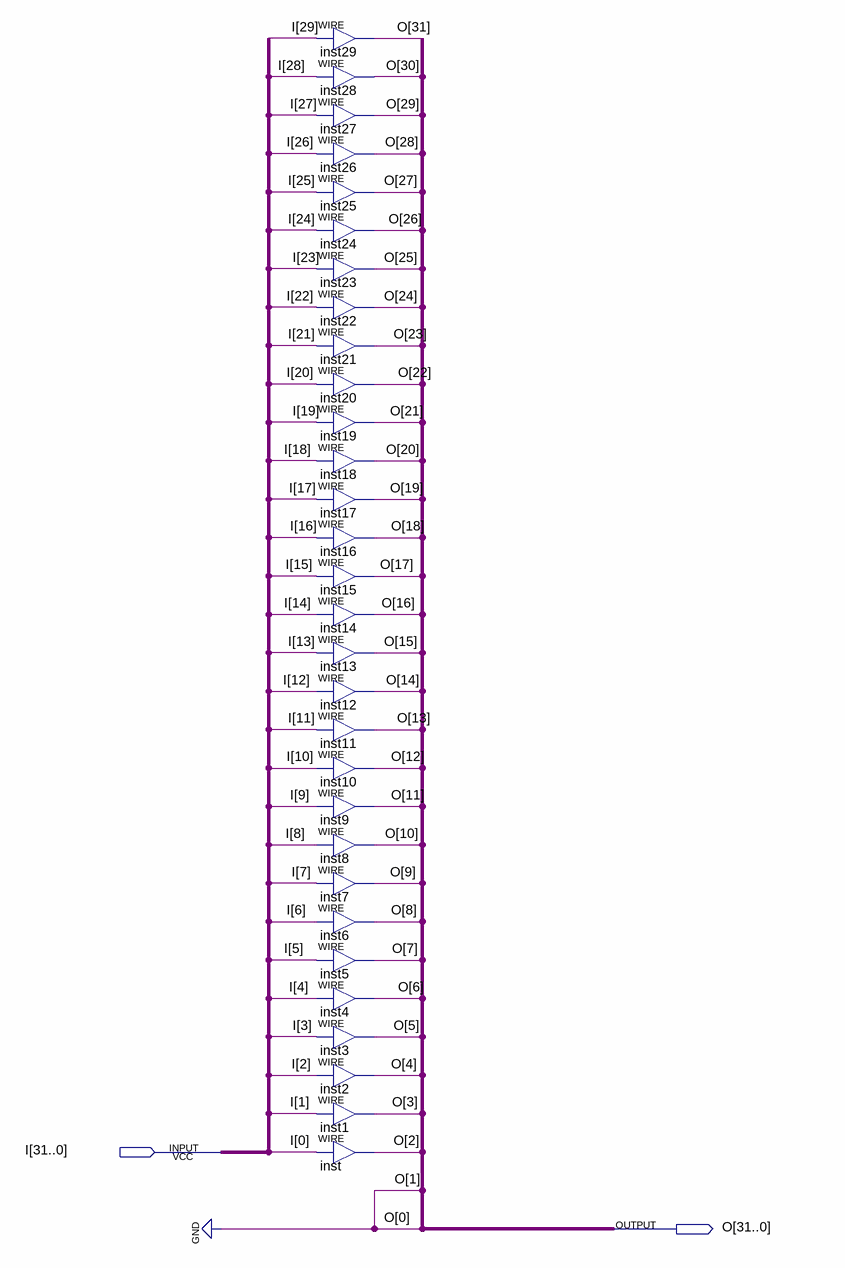
[diagram p0: schematic sheet]
// Quartus schematic Shiftleft2.bdf as structural Verilog: 30 symbols, 2 pins
module Shiftleft2 (
  input  [31:0] I,
  output [31:0] O
);

  assign O[31] = I[29];  // WIRE inst29
  assign O[30] = I[28];  // WIRE inst28
  assign O[29] = I[27];  // WIRE inst27
  assign O[28] = I[26];  // WIRE inst26
  assign O[27] = I[25];  // WIRE inst25
  assign O[26] = I[24];  // WIRE inst24
  assign O[25] = I[23];  // WIRE inst23
  assign O[24] = I[22];  // WIRE inst22
  assign O[23] = I[21];  // WIRE inst21
  assign O[22] = I[20];  // WIRE inst20
  assign O[21] = I[19];  // WIRE inst19
  assign O[20] = I[18];  // WIRE inst18
  assign O[19] = I[17];  // WIRE inst17
  assign O[18] = I[16];  // WIRE inst16
  assign O[17] = I[15];  // WIRE inst15
  assign O[16] = I[14];  // WIRE inst14
  assign O[15] = I[13];  // WIRE inst13
  assign O[14] = I[12];  // WIRE inst12
  assign O[13] = I[11];  // WIRE inst11
  assign O[12] = I[10];  // WIRE inst10
  assign O[11] = I[9];  // WIRE inst9
  assign O[10] = I[8];  // WIRE inst8
  assign O[9] = I[7];  // WIRE inst7
  assign O[8] = I[6];  // WIRE inst6
  assign O[7] = I[5];  // WIRE inst5
  assign O[6] = I[4];  // WIRE inst4
  assign O[5] = I[3];  // WIRE inst3
  assign O[4] = I[2];  // WIRE inst2
  assign O[3] = I[1];  // WIRE inst1
  assign O[2] = I[0];  // WIRE inst

  assign O[1:0] = 2'b00;
endmodule
